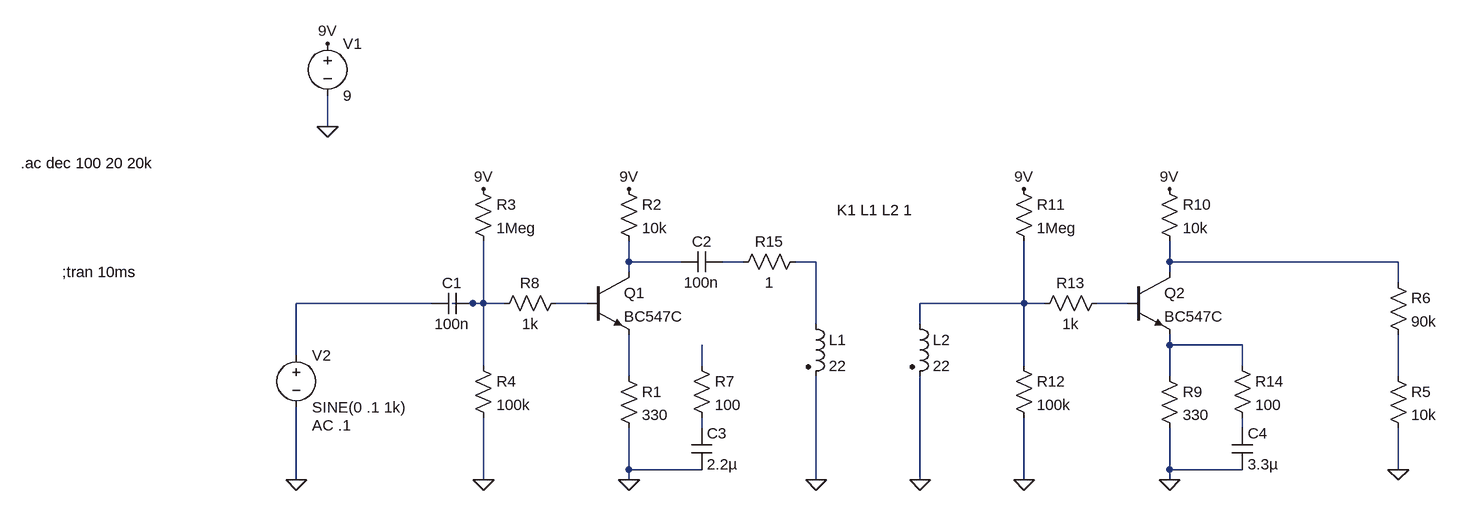
[diagram p0: schematic BJT_Single_Stage.asc]
BJT_Single_Stage.asc, the LTspice schematic file:
Version 4
SHEET 1 1456 680
WIRE -256 -96 -256 -144
WIRE 208 112 208 80
WIRE 288 112 208 112
WIRE 384 112 352 112
WIRE 496 112 464 112
WIRE 1040 112 1040 80
WIRE 1392 112 1040 112
WIRE 208 128 208 112
WIRE 1040 128 1040 112
WIRE 1392 144 1392 112
WIRE -96 176 -304 176
WIRE -32 176 -64 176
WIRE -16 176 -16 80
WIRE -16 176 -32 176
WIRE 16 176 -16 176
WIRE 144 176 96 176
WIRE 816 176 816 80
WIRE 816 176 656 176
WIRE 848 176 816 176
WIRE 976 176 928 176
WIRE 496 208 496 112
WIRE 656 208 656 176
WIRE 1040 240 1040 224
WIRE 1152 240 1040 240
WIRE -304 256 -304 176
WIRE -16 272 -16 176
WIRE 320 272 320 240
WIRE 816 272 816 176
WIRE 1152 272 1152 240
WIRE 208 288 208 224
WIRE 1040 288 1040 240
WIRE 1392 288 1392 224
WIRE 320 368 320 352
WIRE 1152 368 1152 352
WIRE 208 432 208 368
WIRE 320 432 208 432
WIRE 1040 432 1040 368
WIRE 1152 432 1040 432
WIRE 1392 432 1392 368
WIRE -304 448 -304 336
WIRE -16 448 -16 352
WIRE 208 448 208 432
WIRE 496 448 496 288
WIRE 656 448 656 288
WIRE 816 448 816 352
WIRE 1040 448 1040 432
FLAG -256 -96 0
FLAG -304 448 0
FLAG -16 448 0
FLAG 208 448 0
FLAG 1392 432 0
FLAG -256 -224 9V
FLAG -16 0 9V
FLAG 208 0 9V
FLAG 496 448 0
FLAG 656 448 0
FLAG 816 448 0
FLAG 1040 448 0
FLAG 816 0 9V
FLAG 1040 0 9V
SYMBOL npn 144 128 R0
SYMATTR InstName Q1
SYMATTR Value BC547C
SYMBOL res 192 272 R0
SYMATTR InstName R1
SYMATTR Value 330
SYMBOL res 192 -16 R0
SYMATTR InstName R2
SYMATTR Value 10k
SYMBOL res -32 -16 R0
SYMATTR InstName R3
SYMATTR Value 1Meg
SYMBOL res -32 256 R0
SYMATTR InstName R4
SYMATTR Value 100k
SYMBOL res 1376 272 R0
SYMATTR InstName R5
SYMATTR Value 10k
SYMBOL res 1376 128 R0
SYMATTR InstName R6
SYMATTR Value 90k
SYMBOL cap -32 160 R90
WINDOW 0 0 32 VBottom 2
WINDOW 3 32 32 VTop 2
SYMATTR InstName C1
SYMATTR Value 100n
SYMBOL cap 352 96 R90
WINDOW 0 0 32 VBottom 2
WINDOW 3 32 32 VTop 2
SYMATTR InstName C2
SYMATTR Value 100n
SYMBOL voltage -256 -240 R0
WINDOW 123 0 0 Left 2
WINDOW 39 0 0 Left 2
SYMATTR InstName V1
SYMATTR Value 9
SYMBOL voltage -304 240 R0
WINDOW 123 24 124 Left 2
WINDOW 39 24 152 Left 2
SYMATTR Value2 AC .1
SYMATTR InstName V2
SYMATTR Value SINE(0 .1 1k)
SYMBOL cap 304 368 R0
SYMATTR InstName C3
SYMATTR Value 2.2µ
SYMBOL res 304 256 R0
SYMATTR InstName R7
SYMATTR Value 100
SYMBOL res 112 160 R90
WINDOW 0 0 56 VBottom 2
WINDOW 3 32 56 VTop 2
SYMATTR InstName R8
SYMATTR Value 1k
SYMBOL ind2 480 192 R0
SYMATTR InstName L1
SYMATTR Value 22
SYMATTR Type ind
SYMATTR SpiceLine Rser=550
SYMBOL ind2 640 192 R0
SYMATTR InstName L2
SYMATTR Value 22
SYMATTR Type ind
SYMATTR SpiceLine Rser=550
SYMBOL npn 976 128 R0
SYMATTR InstName Q2
SYMATTR Value BC547C
SYMBOL res 1024 272 R0
SYMATTR InstName R9
SYMATTR Value 330
SYMBOL res 1024 -16 R0
SYMATTR InstName R10
SYMATTR Value 10k
SYMBOL res 800 -16 R0
SYMATTR InstName R11
SYMATTR Value 1Meg
SYMBOL res 800 256 R0
SYMATTR InstName R12
SYMATTR Value 100k
SYMBOL res 944 160 R90
WINDOW 0 0 56 VBottom 2
WINDOW 3 32 56 VTop 2
SYMATTR InstName R13
SYMATTR Value 1k
SYMBOL cap 1136 368 R0
SYMATTR InstName C4
SYMATTR Value 3.3µ
SYMBOL res 1136 256 R0
SYMATTR InstName R14
SYMATTR Value 100
SYMBOL res 480 96 R90
WINDOW 0 0 56 VBottom 2
WINDOW 3 32 56 VTop 2
SYMATTR InstName R15
SYMATTR Value 1
TEXT -728 -40 Left 2 !.ac dec 100 20 20k
TEXT -664 128 Left 2 !;tran 10ms
TEXT 528 32 Left 2 !K1 L1 L2 1

The netlist it stands for:
* BJT_Single_Stage.asc
Q1 N001 N007 N012 0 BC547C
R1 N012 0 330
R2 9V N001 10k
R3 9V N006 1Meg
R4 N006 0 100k
R5 N013 0 10k
R6 N004 N013 90k
C1 N006 N005 100n
C2 N002 N001 100n
V1 9V 0 9
V2 N005 0 SINE(0 .1 1k) AC .1
C3 N014 0 2.2µ
R7 N011 N014 100
R8 N007 N006 1k
L1 N003 0 22 Rser=550
L2 N008 0 22 Rser=550
Q2 N004 N009 N010 0 BC547C
R9 N010 0 330
R10 9V N004 10k
R11 9V N008 1Meg
R12 N008 0 100k
R13 N009 N008 1k
C4 N015 0 3.3µ
R14 N010 N015 100
R15 N003 N002 1
.model NPN NPN
.model PNP PNP
.lib standard.bjt
.ac dec 100 20 20k
;tran 10ms
K1 L1 L2 1
.backanno
.end